# Altium schematic sheet Audio_Input_Mic_Array.SchDoc: MEMS Microphone Array
size 279 x 215 mm; DrawnBy: Connor Dack; Engineer: Connor Dack; DocumentNumber: 15; Revision: 1.0; SheetNumber: 15; SheetTotal: 20
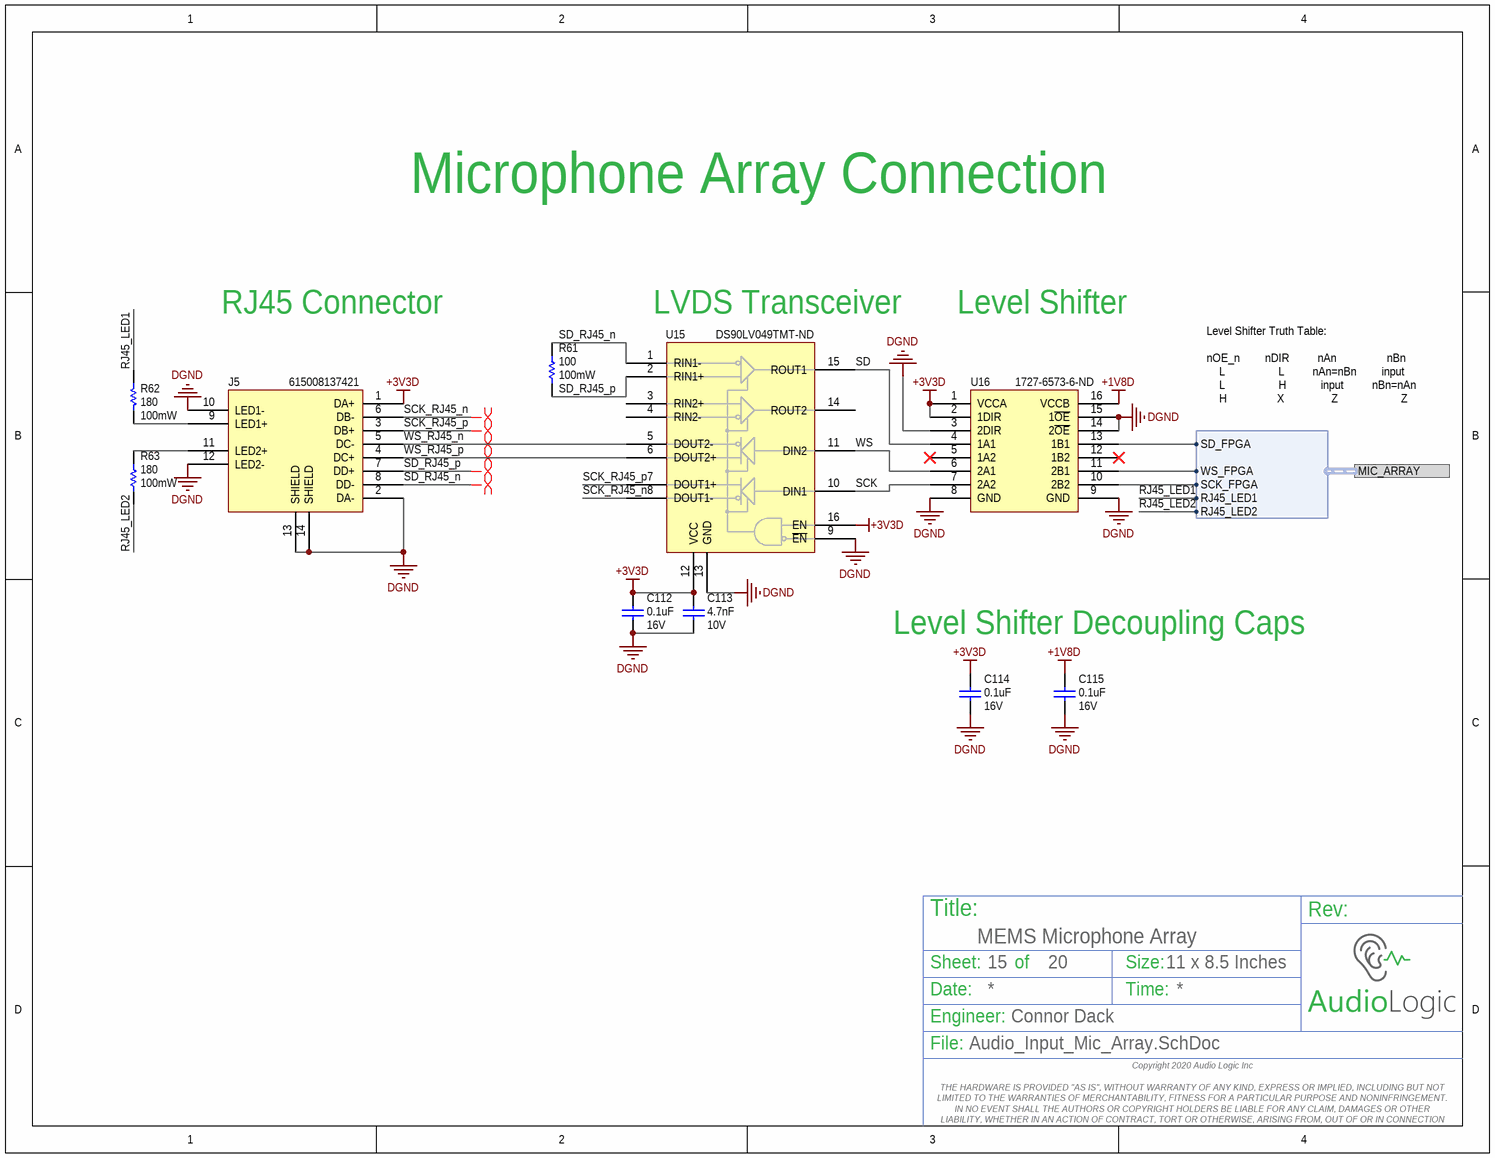
[diagram p0: Audio_Input_Mic_Array.SchDoc]

## Parts
C112  Voltage Rating: 16V  Capacitance: 0.1uF  [3-0603_L]  (hidden comment: CL10F104ZO8NNNC)
C113  Voltage Rating: 10V  Capacitance: 4.7nF  [3-0603_L]  (hidden comment: C0603C472K8RACTU)
C114  Voltage Rating: 16V  Capacitance: 0.1uF  [3-0603_L]  (hidden comment: CL10F104ZO8NNNC)
C115  Voltage Rating: 16V  Capacitance: 0.1uF  [3-0603_L]  (hidden comment: CL10F104ZO8NNNC)
J5  CONN MOD JACK 8P8C R/A SHIELDED  [RJ45]  (value not drawn)
R61  Power Rating: 100mW  Resistance: 100  [3-0603_R_L]  (hidden comment: ERA-3AEB101V)
R62  Power Rating: 100mW  Resistance: 180  [3-0603_R_L]  (hidden comment: ERA-3AEB181V)
R63  Power Rating: 100mW  Resistance: 180  [3-0603_R_L]  (hidden comment: ERA-3AEB181V)
U15  Supplier Part Number 1: DS90LV049TMT-ND  [TSOP65P640X120-16N]  (hidden comment: DS90LV049TMT)
U16  Supplier Part Number 1: 1727-6573-6-ND  [TSOP65P640X120-16N]  (hidden comment: IC TXRX 4BIT DUAL 3ST 16TSSOP)

## Ports
MIC_ARRAY (harness Microphone Array)

## Harnesses
Microphone Array: SD_FPGA, SCK_FPGA, WS_FPGA, RJ45_LED1, RJ45_LED2

## Nets
+1V8D: C115.1 U16.16(VCCB)
+3V3D: C112.1 C113.2 C114.1 J5.1(DA+) U15.12(VCC) U15.16(EN) U16.1(VCCA) U16.2(1DIR)
DGND: C112.2 C113.1 C114.2 C115.2 J5.2(DA-) J5.10(LED1-) J5.12(LED2-) J5.13(SHIELD) J5.14(SHIELD) U15.9(~{EN}) U15.13(GND) U16.3(2DIR) U16.8(GND) U16.9(GND) U16.14(2~{OE}) U16.15(1~{OE})
RJ45_LED1: R62.1 ; port MIC_ARRAY.RJ45_LED1
RJ45_LED2: R63.1 ; port MIC_ARRAY.RJ45_LED2
SCK: U15.10(DIN1) U16.7(2A2)
SCK_RJ45_n: J5.6(DB-) U15.8(DOUT1-)
SCK_RJ45_p: J5.3(DB+) U15.7(DOUT1+)
SD: U15.15(ROUT1) U16.4(1A1)
SD_RJ45_n: J5.8(DD-) R61.2 U15.1(RIN1-)
SD_RJ45_p: J5.7(DD+) R61.1 U15.2(RIN1+)
WS: U15.11(DIN2) U16.6(2A1)
WS_RJ45_n: J5.5(DC-) U15.5(DOUT2-)
WS_RJ45_p: J5.4(DC+) U15.6(DOUT2+)
NetJ5_9: J5.9(LED1+) R62.2
NetJ5_11: J5.11(LED2+) R63.2
NetU16_10: U16.10(2B2) ; port MIC_ARRAY.SCK_FPGA
NetU16_11: U16.11(2B1) ; port MIC_ARRAY.WS_FPGA
NetU16_13: U16.13(1B1) ; port MIC_ARRAY.SD_FPGA

Not connected (* = marked no-connect by the designer): U15 3(RIN2+) 4(RIN2-) 14(ROUT2); U16 5(1A2)* 12(1B2)*

## Layout directives
differential pair: SCK_RJ45_n, SCK_RJ45_p, SD_RJ45_n, SD_RJ45_p, WS_RJ45_n, WS_RJ45_p

## Notes on the sheet
- Microphone Array Connection
- RJ45 Connector
- (near U15) LVDS Transceiver
- Level Shifter
- Level Shifter Truth Table:
  nOE_n        nDIR         nAn                nBn
  L                 L         nAn=nBn        input
  L                 H           input         nBn=nAn
  H                X               Z                    Z
- Level Shifter Decoupling Caps
- Title:
- Sheet:
- of
- Size:
- 11 x 8.5 Inches
- Rev:
- Date:
- Engineer:
- Time:
- File:
- Copyright 2020 Audio Logic Inc
  THE HARDWARE IS PROVIDED "AS IS", WITHOUT WARRANTY OF ANY KIND, EXPRESS OR IMPLIED, INCLUDING BUT NOT LIMITED TO THE WARRANTIES OF MERCHANTABILITY, FITNESS FOR A PARTICULAR PURPOSE AND NONINFRINGEMENT. IN NO EVENT SHALL THE AUTHORS OR COPYRIGHT HOLDERS BE LIABLE FOR ANY CLAIM, DAMAGES OR OTHER LIABILITY, WHETHER IN AN ACTION OF CONTRACT, TORT OR OTHERWISE, ARISING FROM, OUT OF OR IN CONNECTION WITH THE HARDWARE OR THE USE OR OTHER DEALINGS IN THE HARDWARE.

## Library data of the parts
C112 C114 C115 = CL10F104ZO8NNNC: CAP CER 0.1UF 16V Y5V 0603; Manufacturer: Samsung; Tolerance: 80%; Supplier 1: Digi-Key; Stock 1: 40000; Pricing 1: 1=0.1, 10=0.038, 100=0.0169, 500=0.01208, 1000=0.00949 (USD); Mount: Surface Mount; Case/Package: 0603; Case Code (Metric): 1608; Case Code (Imperial): 0603; Min Operating Temperature: -30°C; Max Operating Temperature: 85°C; Package Quantity: 1; Packaging: Tape and Reel; Dielectric: Y5V; Length: 1.6mm; Height: 0.8mm; Width: 0.031inch; Thickness: 0.035inch; Depth: 0.8mm; Radiation Hardening: No; ComponentLink1URL: https://datasheet.ciiva.com/25805/cl10f104zo8nnnc-25805810.pdf; ComponentLink1Description: https://datasheet.ciiva.com/25805/cl10f104zo8nnnc-25805810.pdf; ComponentLink2URL: https://datasheet.ciiva.com/16199/cl10f104zo8nnnc-16199254.pdf; ComponentLink2Description: https://datasheet.ciiva.com/16199/cl10f104zo8nnnc-16199254.pdf; Supplier Part Number 1: 1276-1258-6-ND; Manufacturer Part Number: CL10F104ZO8NNNC
C113 = C0603C472K8RACTU: CAP CER 4700PF 10V X7R 0603; Manufacturer: KEMET; Dielectric Material: Ceramic; Tolerance: 10%; Supplier 1: Digi-Key; Manufacturer Part Number: C0603C472K8RACTU; Stock 1: 15005; Pricing 1: 1=0.1, 10=0.053, 100=0.0236, 500=0.0168, 1000=0.0132 (USD); Mount: Surface Mount; Case/Package: 0603; Case Code (Metric): 1608; Case Code (Imperial): 0603; Contact Plating: Tin,Matte; Min Operating Temperature: -55°C; Max Operating Temperature: 125°C; Packaging: Tape and Reel; Package Quantity: 4000; Voltage Rating (DC): 10V; Dielectric: X7R; Termination: SMD/SMT; Length: 1.6mm; Width: 0.031inch; Thickness: 0.034inch; Depth: 0.8mm; REACH SVHC: No SVHC; ComponentLink1URL: http://www.mouser.com/ds/2/212/KEM_C1002_X7R_SMD-1102033.pdf; ComponentLink1Description: http://www.mouser.com/ds/2/212/KEM_C1002_X7R_SMD-1102033.pdf; ComponentLink2URL: http://components.arrow.com/part/dataview/3445604S8609586N7429; ComponentLink2Description: http://components.arrow.com/part/dataview/3445604S8609586N7429; ComponentLink3URL: https://search.kemet.com/component-edge/download/datasheet/C0603C472K8RACTU.pdf; ComponentLink3Description: https://search.kemet.com/component-edge/download/datasheet/C0603C472K8RACTU.pdf; ComponentLink4URL: http://capacitoredge.kemet.com/capedge2/DataSheet?pn=C0603C472K8RAC7867; ComponentLink4Description: http://capacitoredge.kemet.com/capedge2/DataSheet?pn=C0603C472K8RAC7867; Supplier Part Number 1: 399-9092-6-ND
J5 = 615008137421: Jack Modular Connector 8p8c (RJ45, Ethernet) 90° Angle (Right) Shielded, EMI Finger Cat5; Manufacturer: Wurth Electronics; Current Rating: 1.5A; Mating Cycles: 500; Gender: Female; Connector Type: RJ45,Socket,Jack; Voltage Rating (AC): 120V; Number of Positions: 8; Number of Ports: 1; Insulation Resistance: 500MR; Direction: Up; Supplier 1: Digi-Key; Stock 1: 1494; Pricing 1: 1=2.67, 10=2.621, 50=2.52, 100=2.419, 250=2.318 (USD); Mount: Through Hole,PCB; Contact Plating: Tin,Gold; Contact Material: Copper Alloy; Colour: Black,Green,Yellow; Housing Material: PBT; Min Operating Temperature: -40°C; Max Operating Temperature: 85°C; Shielding: Shielded; Packaging: Tray; Package Quantity: 60; Number of Rows: 1; Termination: Through Hole; Number of Contacts: 8; Orientation: Right Angle; Length: 13.46mm; Height: 16.93mm; Width: 16.25mm; Depth: 15.75mm; REACH SVHC: Unknown; Flammability Rating: UL94 V-0; ComponentLink1URL: https://datasheet.ciiva.com/11726/0900766b80f88673-11726176.pdf; ComponentLink1Description: https://datasheet.ciiva.com/11726/0900766b80f88673-11726176.pdf; ComponentLink2URL: https://datasheet.ciiva.com/4561/615008137421-71402-4561624.pdf; ComponentLink2Description: https://datasheet.ciiva.com/4561/615008137421-71402-4561624.pdf; ComponentLink3URL: https://datasheet.ciiva.com/686/615008137421-686729.pdf; ComponentLink3Description: https://datasheet.ciiva.com/686/615008137421-686729.pdf; ComponentLink4URL: https://datasheet.ciiva.com/6913/76606-6913951.pdf; ComponentLink4Description: https://datasheet.ciiva.com/6913/76606-6913951.pdf; ComponentLink5URL: https://datasheet.ciiva.com/48689/001088215-da-01-en-wr-com-modular-jack-615008137421-48689541.pdf; ComponentLink5Description: https://datasheet.ciiva.com/48689/001088215-da-01-en-wr-com-modular-jack-615008137421-48689541.pdf; Supplier Part Number 1: 732-2112-ND; Manufacturer Part Number: 615008137421
R61 = ERA-3AEB101V: RES SMD 100 OHM 0.1% 1/10W 0603; Manufacturer: Panasonic ECG; Voltage Rating: 75V; Temperature Coefficient: 25ppm/°C; Supplier 1: Digi-Key; Manufacturer Part Number: ERA-3AEB101V; Stock 1: 123480; Pricing 1: 1=0.35, 10=0.3, 100=0.1172, 1000=0.0491, 2500=0.045 (USD); Mount: Surface Mount; Case/Package: 0603; Number of Pins: 2; Case Code (Metric): 1608; Case Code (Imperial): 0603; Contact Plating: Tin; Min Operating Temperature: -55°C; Max Operating Temperature: 155°C; Tolerance: 0.1%; Packaging: Tape and Reel; Package Quantity: 5000; Composition: Metal Film,Thin Film; Number of Terminations: 2; Termination: SMD/SMT; Military Standard: Not; Max Power Dissipation: 100mW; Length: 1.6mm; Height: 0.45mm; Width: 0.8mm; Depth: 0.8mm; Radiation Hardening: No; REACH SVHC: No SVHC; ComponentLink1URL: https://datasheet.ciiva.com/46422/485442-46422517.pdf; ComponentLink1Description: https://datasheet.ciiva.com/46422/485442-46422517.pdf; ComponentLink2URL: https://datasheet.ciiva.com/7830/485442-7830582.pdf; ComponentLink2Description: https://datasheet.ciiva.com/7830/485442-7830582.pdf; ComponentLink3URL: https://datasheet.ciiva.com/46422/485442-46422518.pdf; ComponentLink3Description: https://datasheet.ciiva.com/46422/485442-46422518.pdf; ComponentLink4URL: https://datasheet.ciiva.com/17207/aoa0000ce26-17207959.pdf; ComponentLink4Description: https://datasheet.ciiva.com/17207/aoa0000ce26-17207959.pdf; ComponentLink5URL: https://datasheet.ciiva.com/5734/485442-5734520.pdf; ComponentLink5Description: https://datasheet.ciiva.com/5734/485442-5734520.pdf; ComponentLink6URL: https://datasheet.ciiva.com/5734/485442-5734521.pdf; ComponentLink6Description: https://datasheet.ciiva.com/5734/485442-5734521.pdf; ComponentLink7URL: https://datasheet.ciiva.com/28513/39837-28513817.pdf; ComponentLink7Description: https://datasheet.ciiva.com/28513/39837-28513817.pdf; ComponentLink8URL: https://datasheet.ciiva.com/11808/0900766b80fe20f7-11808029.pdf; ComponentLink8Description: https://datasheet.ciiva.com/11808/0900766b80fe20f7-11808029.pdf; ComponentLink9URL: https://datasheet.ciiva.com/16725/70068849-16725037.pdf; ComponentLink9Description: https://datasheet.ciiva.com/16725/70068849-16725037.pdf; ComponentLink10URL: https://datasheet.ciiva.com/45928/54aoa0000ce26-45928637.pdf; ComponentLink10Description: https://datasheet.ciiva.com/45928/54aoa0000ce26-45928637.pdf; ComponentLink11URL: https://datasheet.ciiva.com/9186/aoa0000ce26-9186735.pdf; ComponentLink11Description: https://datasheet.ciiva.com/9186/aoa0000ce26-9186735.pdf; ComponentLink12URL: https://datasheet.ciiva.com/48425/era-eng-tds-48425407.pdf; ComponentLink12Description: https://datasheet.ciiva.com/48425/era-eng-tds-48425407.pdf; ComponentLink13URL: https://datasheet.ciiva.com/29183/450355-da-01-en-widerstand-0603-era-29183658.pdf; ComponentLink13Description: https://datasheet.ciiva.com/29183/450355-da-01-en-widerstand-0603-era-29183658.pdf; Supplier Part Number 1: P100DBDKR-ND
R62 R63 = ERA-3AEB181V: RES SMD 180 OHM 0.1% 1/10W 0603; Manufacturer: Panasonic; Manufacturer Part Number: ERA3AEB181V; Voltage Rating: 75V; Temperature Coefficient: 25ppm/°C; Stock 1: 9289; Pricing 1: 1=0.35, 10=0.3, 100=0.1172, 1000=0.0491, 2500=0.045 (USD); Mount: Surface Mount; Case/Package: 0603; Number of Pins: 2; Case Code (Metric): 1608; Case Code (Imperial): 0603; Contact Plating: Tin; Min Operating Temperature: -55°C; Max Operating Temperature: 155°C; Composition: Thin Film; Tolerance: 0.1%; Packaging: Tape and Reel; Package Quantity: 1; Number of Terminations: 2; Termination: SMD/SMT; Military Standard: Not; Max Power Dissipation: 100mW; Voltage Rating (DC): 75V; Length: 1.6mm; Height: 0.45mm; Width: 0.8mm; Depth: 0.8mm; Radiation Hardening: No; REACH SVHC: No SVHC; Lead Free: Lead Free; ComponentLink1URL: https://datasheet.ciiva.com/11808/0900766b80fe20f7-11808021.pdf; ComponentLink1Description: https://datasheet.ciiva.com/11808/0900766b80fe20f7-11808021.pdf; ComponentLink2URL: https://datasheet.ciiva.com/9184/aoa0000ce26-9184902.pdf; ComponentLink2Description: https://datasheet.ciiva.com/9184/aoa0000ce26-9184902.pdf; ComponentLink3URL: https://datasheet.ciiva.com/30263/54aoa0000ce26-30263318.pdf; ComponentLink3Description: https://datasheet.ciiva.com/30263/54aoa0000ce26-30263318.pdf; ComponentLink4URL: https://datasheet.ciiva.com/5860/485442-5860503.pdf; ComponentLink4Description: https://datasheet.ciiva.com/5860/485442-5860503.pdf; ComponentLink5URL: https://datasheet.ciiva.com/48425/era-eng-tds-48425431.pdf; ComponentLink5Description: https://datasheet.ciiva.com/48425/era-eng-tds-48425431.pdf; ComponentLink6URL: https://datasheet.ciiva.com/5860/485442-5860505.pdf; ComponentLink6Description: https://datasheet.ciiva.com/5860/485442-5860505.pdf; ComponentLink7URL: https://datasheet.ciiva.com/9117/aoa0000ce26-9117390.pdf; ComponentLink7Description: https://datasheet.ciiva.com/9117/aoa0000ce26-9117390.pdf; ComponentLink8URL: https://datasheet.ciiva.com/7909/485442-7909087.pdf; ComponentLink8Description: https://datasheet.ciiva.com/7909/485442-7909087.pdf; ComponentLink9URL: https://datasheet.ciiva.com/48530/era-eng-tds-48530575.pdf; ComponentLink9Description: https://datasheet.ciiva.com/48530/era-eng-tds-48530575.pdf; ComponentLink10URL: https://datasheet.ciiva.com/29183/450425-da-01-en-widerstand-0603-era-29183672.pdf; ComponentLink10Description: https://datasheet.ciiva.com/29183/450425-da-01-en-widerstand-0603-era-29183672.pdf; Supplier 1: Digi-Key; Supplier Part Number 1: P180DBDKR-ND
U15 = DS90LV049TMT: IC LDVR/RCVR PAIR LVDS 16TSSOP; Manufacturer: TI National Semiconductor; Max Power Dissipation: 866mW; Number of Receivers: 2; Propagation Delay: 3.5ns; Max Supply Voltage: 3.6V; Min Supply Voltage: 3V; Operating Supply Voltage: 3.3V; Data Rate: 400Mbps; Max Supply Current: 35mA; Number of Channels: 4; Power Consumption: 70W; Logic Function: Transceiver; Supplier 1: Digi-Key; Manufacturer Part Number: DS90LV049TMT; Stock 1: 181; Pricing 1: 1=4.2, 10=3.77, 100=3.0888, 500=2.62944, 1000=2.2176 (USD); Mount: Surface Mount; Case/Package: TSSOP; Number of Pins: 16; Min Operating Temperature: -40°C; Max Operating Temperature: 85°C; Packaging: Rail/Tube; Package Quantity: 92; Number of Elements: 2; Number of Drivers: 2; Turn-On Delay Time: 3.5ns; Power Dissipation: 866mW; Radiation Hardening: No; REACH SVHC: No SVHC; Lead Free: Contains Lead; ComponentLink1URL: https://datasheet.ciiva.com/12262/snls159c-70565-12262450.pdf; ComponentLink1Description: https://datasheet.ciiva.com/12262/snls159c-70565-12262450.pdf; ComponentLink2URL: https://datasheet.ciiva.com/1498/1787948-1498728.pdf; ComponentLink2Description: https://datasheet.ciiva.com/1498/1787948-1498728.pdf; ComponentLink3URL: https://datasheet.ciiva.com/15133/getdatasheetpartid-646755-15133256.pdf; ComponentLink3Description: https://datasheet.ciiva.com/15133/getdatasheetpartid-646755-15133256.pdf; ComponentLink4URL: https://datasheet.ciiva.com/3151/ds90lv049-3151691.pdf; ComponentLink4Description: https://datasheet.ciiva.com/3151/ds90lv049-3151691.pdf; ComponentLink5URL: https://datasheet.ciiva.com/26832/ds90lv049tmt-26832770.pdf; ComponentLink5Description: https://datasheet.ciiva.com/26832/ds90lv049tmt-26832770.pdf
U16 = 74AVC4T245PW,118: Voltage Level Translator Bidirectional 2 Circuit 2 Channel 380Mbps 16-TSSOP; Manufacturer: NXP Semiconductors; Max Supply Voltage: 3.6V; Min Supply Voltage: 800mV; Propagation Delay: 14.7ns; Number of Channels: 4; Number of Elements: 2; Logic Function: Transceiver,Translator; Low Level Output Current: 12mA; Turn-On Delay Time: 14.5ns; Polarity: Non-Inverting; High Level Output Current: -12mA; Quiescent Current: 70uA; Supplier 1: Digi-Key; Stock 1: 22627; Pricing 1: 1=0.9, 10=0.804, 100=0.6266, 500=0.51764, 1000=0.40866 (USD); Mount: Surface Mount; Case/Package: TSSOP; Number of Pins: 16; Contact Plating: Gold; Min Operating Temperature: -40°C; Max Operating Temperature: 125°C; Packaging: Tape and Reel; Package Quantity: 2500; Data Rate: 380Mbps; Number of Bits: 4; Number of Circuits: 2; Radiation Hardening: No; Lead Free: Lead Free; ComponentLink1URL: https://datasheet.ciiva.com/1900/74avc4t245-1900214.pdf; ComponentLink1Description: https://datasheet.ciiva.com/1900/74avc4t245-1900214.pdf; ComponentLink2URL: https://datasheet.ciiva.com/1900/74avc4t245-1900215.pdf; ComponentLink2Description: https://datasheet.ciiva.com/1900/74avc4t245-1900215.pdf; ComponentLink3URL: https://datasheet.ciiva.com/1900/74avc4t245-1900216.pdf; ComponentLink3Description: https://datasheet.ciiva.com/1900/74avc4t245-1900216.pdf; ComponentLink4URL: https://datasheet.ciiva.com/15086/getdatasheetpartid-442686-15086830.pdf; ComponentLink4Description: https://datasheet.ciiva.com/15086/getdatasheetpartid-442686-15086830.pdf; Manufacturer Part Number: 74AVC4T245PW,118